# Altium schematic sheet SDEC944-xD_D‚tecteur_ouverture_maison_(signal).SchDoc: Détecteur ouverture porte maison (signal)
size 393 x 270 mm; CompanyName: Seccom; Address1: 521, rue du capt. François Garbit; Address2: 69440 Mornant; Address3: seccom@seccom.fr; Address4: www.seccom.fr; DocumentNumber: 10; SheetNumber: 10; SheetTotal: 22; PageSetup: Record=PageOptions|CenterHorizontal=True|CenterVertical=True|PrintScale=0.74|XCorrection=1.00|YCorrection=1.00|PrintKind=0|BorderSize=5000000|LeftOffset=0|BottomOffset=0|Orientation=2|PaperLength=1000|PaperWidth=1000|Scale=100|PaperSource=7|PrintQuality=-4|MediaType=1|DitherType=10|PaperKind=A4|PrintScaleMode=1
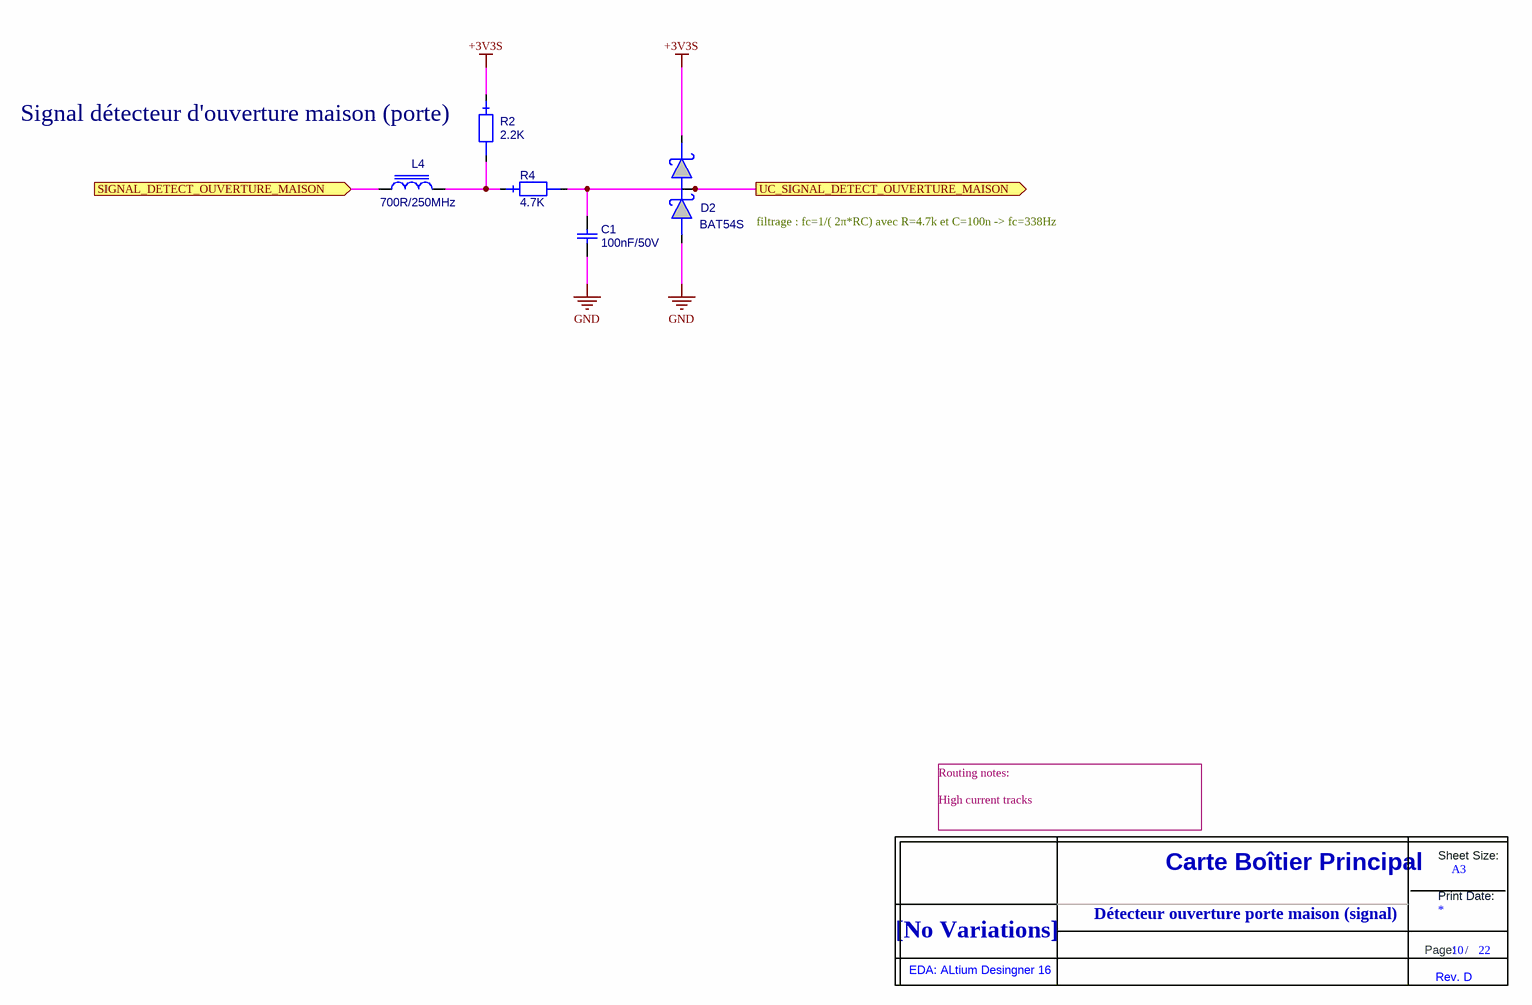
[diagram p0: SDEC944-xD_D‚tecteur_ouverture_maison_(signal).SchDoc]

## Parts
C1  value 100nF/50V  [0603_ReflowSoldering_CAP]  (hidden comment: C_0603_X7R_10%_100N-50V)
D2  BAT54S  [SOT23_3L_ReflowSoldering]
L4  value 700R/250MHz  [0603_ReflowSoldering_CAP]  (hidden comment: IND_FERRITE_0603_742792643)
R2  value 2.2K  [0603_ReflowSoldering_RES]  (hidden comment: RES_0603_1%_100PPM_2.2K)
R4  value 4.7K  [0603_ReflowSoldering_RES]  (hidden comment: RES_0603_1%_100PPM_4.7K)
Title_new  DNI  (value not drawn)  (graphical)

## Ports
SIGNAL_DETECT_OUVERTURE_MAISON (in), UC_SIGNAL_DETECT_OUVERTURE_MAISON (out)

## Nets
+3V3S: D2.2 R2.1
GND: C1.2 D2.1
SIGNAL_DETECT_OUVERTURE_MAISON: L4.1 ; port SIGNAL_DETECT_OUVERTURE_MAISON
UC_SIGNAL_DETECT_OUVERTURE_MAISON: C1.1 D2.3 R4.2 ; port UC_SIGNAL_DETECT_OUVERTURE_MAISON
NetL4_2: L4.2 R2.2 R4.1

## Notes on the sheet
- (near R2) Signal détecteur d'ouverture maison (porte)
- filtrage : fc=1/( 2π*RC) avec R=4.7k et C=100n -> fc=338Hz
- Routing notes:
  High current tracks
- Détecteur ouverture porte maison (signal)
- (in symbol Title_new) Sheet Size:; Carte Boîtier Principal; A3; Print Date:; [No Variations]; Page:; /; EDA: ALtium Desingner 16; Rev. D

## Library data of the parts
C1 = C_0603_X7R_10%_100N-50V: Condensateur céramique, X7R, 10%, CMS 0603, 100nF/50V; Creation: FB (29/02/12); Boitier: 0603; Remarque: {Remarque}; Fabricant: Kemet; Ref Fab: C0603C104K5RAC; Coeff: 1; ComponentLink1URL: O:\_Documentation\Datasheets\Kemet\Condos_Ceramic_CMS.pdf; ComponentLink2URL: o:\_Documentation\Datasheets\_BOITIERS\PASSIF_CMS\; Config: *; ComponentLink1Description: Datasheet; ComponentLink2Description: Datasheet Boitier; Supplier 1: Farnell; Supplier Part Number 1: 1288255
D2 = BAT54S: Diode Schottky double, BAT54 en série, Vrrm=30V, If=200mA, Vf=0.4Vmax, CMS; Creation: JMP 05/09/2002; Verification: GO (26/09/02); Reference: 000206/00; Boitier: SOT23_3L; Remarque: {Remarque}; Coeff: 1; Fabricant: NXP; ComponentLink1URL: O:\_Documentation\Datasheets\NXP\BAT54_series.pdf; ComponentLink2URL: o:\_Documentation\Datasheets\_BOITIERS\ACTIF_CMS\SOT\SOT_23_3P_(Schneider).PDF; Config: *; ComponentLink1Description: Datasheet; ComponentLink2Description: Datasheet Boitier; Ref Fab: BAT54S; Supplier 1: Farnell; Supplier Part Number 1: 1081194; Value: BAT54S; Supplier 2: Mouser; Supplier Part Number 2: 771-BAT54S-T/R
L4 = IND_FERRITE_0603_742792643: Inductance à ferrite multicouches CMS, imp=700R@250MHz, +/-25%, Rdc=350mR, I=400mA; Creation: PDP (02/08/12); Boitier: 0603; Coeff: 1; Fabricant: Wurth Elektronik; ComponentLink1URL: o:\_Documentation\Datasheets\Murata\Ferrite_BLM21P.pdf; Config: *; ComponentLink1Description: Datasheet; ComponentLink2Description: Datasheet Boitier; Ref Fab: 742792643; Supplier 1: Farnell; Supplier Part Number 1: 1800349
R2 = RES_0603_1%_100PPM_2.2K: Résistance, 0.100W, 1%, 100ppm, 75V, 2.2K; Creation: JPL (05/07/12); Boitier: 0603; Remarque: {Remarque}; Fabricant: Vishay; Ref Fab: CRCW06032K20FKEA; Coeff: 1; Verification: *; ComponentLink1URL: O:\_Documentation\Datasheets\Vishay\Resistances_D-CRCWe3.pdf; ComponentLink2URL: o:\_Documentation\Datasheets\_BOITIERS\PASSIF_CMS\; Config: *; ComponentLink1Description: Datasheet; ComponentLink2Description: Datasheet Boitier; Supplier 1: Farnell; Supplier 2: RadioSpares; Supplier Part Number 1: 1469765; Supplier Part Number 2: 6790112
R4 = RES_0603_1%_100PPM_4.7K: Résistance, 0.100W, 1%, 100ppm, 75V, 4.7K; Creation: JPL (05/07/12); Boitier: 0603; Remarque: {Remarque}; Fabricant: Vishay; Ref Fab: CRCW06034K70FKEA; Coeff: 1; Verification: *; ComponentLink1URL: O:\_Documentation\Datasheets\Vishay\Resistances_D-CRCWe3.pdf; ComponentLink2URL: o:\_Documentation\Datasheets\_BOITIERS\PASSIF_CMS\; Config: *; ComponentLink1Description: Datasheet; ComponentLink2Description: Datasheet Boitier; Supplier 1: Farnell; Supplier 2: RadioSpares; Supplier Part Number 1: 1469807; Supplier Part Number 2: 6790484
Title_new = Title_new